# Altium project PCB_Project.PrjPcb
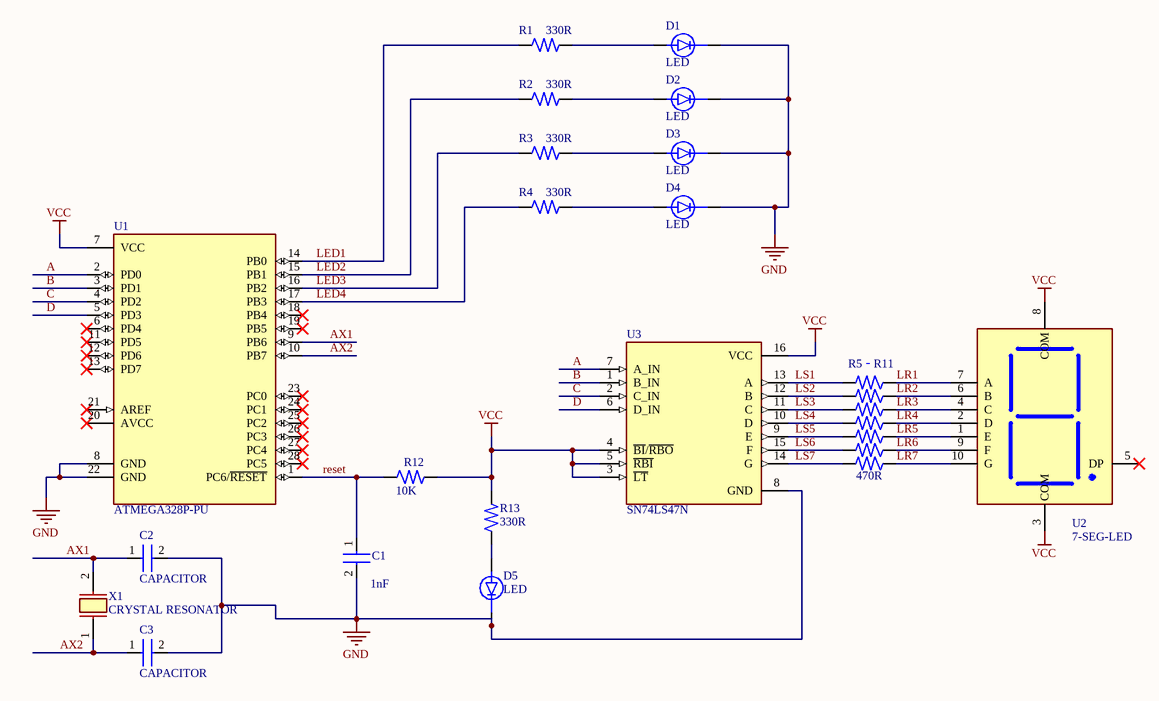
[diagram p0: Sheet1.SchDoc]
1 sheet, 25 parts. Net scope: global (net labels, ports and power ports of the same name join across sheets).
Board files: PCB1.PcbDoc, PCB2.PcbDoc

## Sheet Sheet1.SchDoc
size A4; SheetNumber: 1; SheetTotal: 1

### Parts
C1  1nF  [CAP_8x11mm]
C2  CAPACITOR  [CAP_8x11mm]
C3  CAPACITOR  [CAP_8x11mm]
D1  LED  [LED-TH-2.54mm-RED]
D2  LED  [LED-TH-2.54mm-RED]
D3  LED  [LED-TH-2.54mm-RED]
D4  LED  [LED-TH-2.54mm-RED]
D5  LED  [LED-TH-2.54mm-RED]
R1  330R  [RES0805_SMD]
R2  330R  [RES0805_SMD]
R3  330R  [RES0805_SMD]
R4  330R  [RES0805_SMD]
R5  470R  [RES0805_SMD]
R6  470R  [RES0805_SMD]  (value not drawn)
R7  470R  [RES0805_SMD]  (value not drawn)
R8  470R  [RES0805_SMD]  (value not drawn)
R9  470R  [RES0805_SMD]  (value not drawn)
R10  470R  [RES0805_SMD]  (value not drawn)
R11  470R  [RES0805_SMD]  (value not drawn)
R12  10K  [RES0805_SMD]
R13  330R  [RES0805_SMD]
U1  ATMEGA328P-PU  [DIP794W46P254L2967H457Q28B]
U2  7-SEG-LED  [LED_INND-TS56YGAB]
U3  SN74LS47N  [DIP794W45P254L1930H508Q16]
X1  CRYSTAL RESONATOR  [XTAL_HC49P488W43L1150T466H350]

### Nets
GND: C1.2 C2.2 C3.2 D1.2(K) D2.2(K) D3.2(K) D4.2(K) D5.2(K) U1.8(GND) U1.22(GND) U3.8(GND)
VCC: R12.2 R13.2 U1.7(VCC) U2.3(COM) U2.8(COM) U3.3(~{LT}) U3.4(~{BI}/~{RBO}) U3.5(~{RBI}) U3.16(VCC)
A: U1.2(PD0) U3.7(A_IN)
AX1: C2.1 U1.9(PB6) X1.2
AX2: C3.1 U1.10(PB7) X1.1
B: U1.3(PD1) U3.1(B_IN)
C: U1.4(PD2) U3.2(C_IN)
D: U1.5(PD3) U3.6(D_IN)
LED1: R1.1 U1.14(PB0)
LED2: R2.1 U1.15(PB1)
LED3: R3.1 U1.16(PB2)
LED4: R4.1 U1.17(PB3)
LR1: R5.1 U2.7(A)
LR2: R6.1 U2.6(B)
LR3: R7.1 U2.4(C)
LR4: R8.1 U2.2(D)
LR5: R9.1 U2.1(E)
LR6: R10.1 U2.9(F)
LR7: R11.1 U2.10(G)
LS1: R5.2 U3.13(A)
LS2: R6.2 U3.12(B)
LS3: R7.2 U3.11(C)
LS4: R8.2 U3.10(D)
LS5: R9.2 U3.9(E)
LS6: R10.2 U3.15(F)
LS7: R11.2 U3.14(G)
reset: C1.1 R12.1 U1.1(PC6/~{RESET})
NetD1_1: D1.1(A) R1.2
NetD2_1: D2.1(A) R2.2
NetD3_1: D3.1(A) R3.2
NetD4_1: D4.1(A) R4.2
NetD5_1: D5.1(A) R13.1

Not connected (* = marked no-connect by the designer): U1 6(PD4)* 11(PD5)* 12(PD6)* 13(PD7)* 18(PB4)* 19(PB5)* 20(AVCC)* 21(AREF)* 23(PC0)* 24(PC1)* 25(PC2)* 26(PC3)* 27(PC4)* 28(PC5)*; U2 5(DP)*

### Notes on the sheet
- (near R5) -

### Library data of the parts
C1 = CAPACITOR: Design Item ID: *; Package: *; Size: *; Value: *; MF: *; MP: *; Supplier: *
R1-R13 = RESISTOR: Resistor Symbol; Design Item ID: *; Package: *; Size: *; Value: *; MF: *; MP: *; Supplier: *
U1 = ATMEGA328P-PU: ATmega Series 20 MHz 32 KB Flash 2 KB SRAM 8-Bit Microcontroller - DIP-28; MP: ATMEGA328P-PU; Package: None; Availability: Unavailable; Price: None; Value: *
U2 = 7-SEG-LED: MF: {'manufacturer': u'Inolux'}; MP: INND-TS56YGAB; Package: None; Price: None; Value: *; Availability: Unavailable
U3 = SN74LS47N: BCD-to-Seven-Segment Decoders/Drivers; MF: Texas Instruments; SnapEDA_Link: https://www.snapeda.com/parts/SN74LS47N/Texas+Instruments/view-part/?ref=snap; Package: PDIP-16 Texas Instruments; Value: *; MP: SN74LS47N; Check_prices: https://www.snapeda.com/parts/SN74LS47N/Texas+Instruments/view-part/?ref=eda
C2 C3 = CAPACITOR: Design Item ID: *; Package: *; Size: *; Value: *; MF: *; MP: *; Supplier: *
X1 = CRYSTAL RESONATOR: Design Item ID: *; Package: *; Value: *; MF: *; MP: *